# Altium schematic sheet Buck.SchDoc
size A4
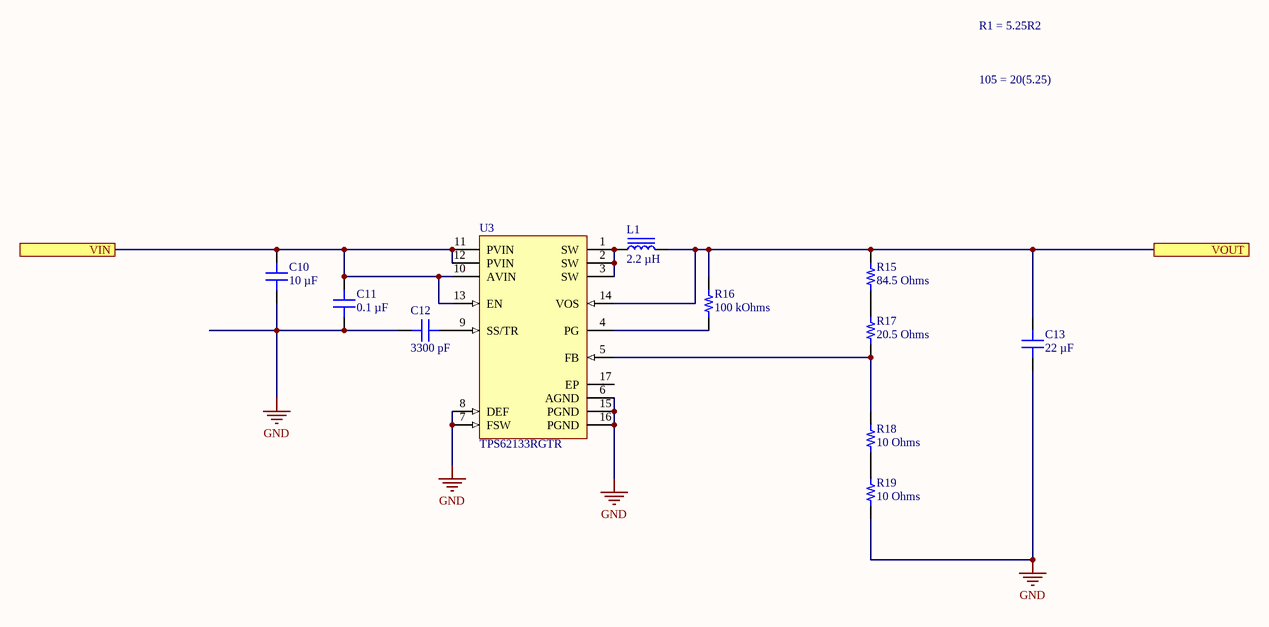
[diagram p0: Buck.SchDoc]

## Parts
C10  10 µF  [CAP 0805_2012]
C11  0.1 µF  [CAP 0805_2012]
C12  3300 pF  [CAP 0805_2012]
C13  22 µF  [CAP 0805_2012]
L1  2.2 µH  [BOURNS SRP5030T]
R15  84.5 Ohms  [RES 0805_2012]
R16  100 kOhms  [RES 0805_2012]
R17  20.5 Ohms  [RES 0805_2012]
R18  10 Ohms  [RES 0805_2012]
R19  10 Ohms  [RES 0805_2012]
U3  TPS62133RGTR  [RGT0016C_V]

## Ports
VIN, VOUT

## Nets
GND: C10.1 C11.1 C12.1 C13.1 R19.1 U3.6(AGND) U3.7(FSW) U3.8(DEF) U3.15(PGND) U3.16(PGND)
VIN: C10.2 C11.2 U3.10(AVIN) U3.11(PVIN) U3.12(PVIN) U3.13(EN) ; port VIN
VOUT: C13.2 L1.2 R15.2 R16.2 U3.14(VOS) ; port VOUT
NetC12_2: C12.2 U3.9(SS/TR)
NetL1_1: L1.1 U3.1(SW) U3.2(SW) U3.3(SW)
NetR15_1: R15.1 R17.2
NetR16_1: R16.1 U3.4(PG)
NetR17_1: R17.1 R18.2 U3.5(FB)
NetR18_1: R18.1 R19.2

Not connected (* = marked no-connect by the designer): U3 17(EP)

## Notes on the sheet
- R1 = 5.25R2
- 105 = 20(5.25)

## Library data of the parts
C10 = CL21Y106KPQVPNE: CAP CER 10UF 10V X7S 0805; manufacturer: Samsung Electro-Mechanics; Tolerance: ±10%; Part Number: CL21Y106KPQVPNE; Value: 10 µF; Applications: Automotive; Capacitance: 10 µF; componentlink1description: Datasheet; componentlink1url: http://www.samsungsem.com/kr/support/product-search/mlcc/CL21Y106KPQVPNE.jsp; componentlink2description: DigiKey Link; componentlink2url: https://www.digikey.com/en/products/detail/samsung-electro-mechanics/CL21Y106KPQVPNE/5961169; Device Package: 0805 (2012 Metric); lastupdated: 2023-10-22 7:13:43 PM; Lifecycle Status: Active; Minimum Order: 1; Mounting Type: Surface Mount, MLCC; Operating Temperature: -55°C ~ 125°C; Package / Case: 0805 (2012 Metric); packaging: TapeAndReel; partid: 2979; Part Status: Active; price: 0.06; Ratings: AEC-Q200; series: CL; Size / Dimension: 0.079" L x 0.049" W (2.00mm x 1.25mm); Supplier 1: DigiKey; Supplier Part Number 1: 1276-6685-1-ND; Temperature Coefficient: X7S; Thickness (Max): 0.055" (1.40mm); Voltage - Rated: 10V
C11 = CC0805MRX7R9BB104: CAP CER 0.1UF 50V X7R 0805; manufacturer: Yageo; Tolerance: ±20%; Part Number: CC0805MRX7R9BB104; Value: 0.1 µF; Applications: General Purpose; Capacitance: 0.1 µF; componentlink1description: Datasheet; componentlink1url: https://www.yageo.com/upload/media/product/productsearch/datasheet/mlcc/UPY-GPHC_X7R_6.3V-to-50V_18.pdf; componentlink2description: DigiKey Link; componentlink2url: https://www.digikey.com/en/products/detail/yageo/CC0805MRX7R9BB104/5884281; Device Package: 0805 (2012 Metric); lastupdated: 2023-10-22 7:13:44 PM; Lifecycle Status: Active; Minimum Order: 1; Mounting Type: Surface Mount, MLCC; Operating Temperature: -55°C ~ 125°C; Package / Case: 0805 (2012 Metric); packaging: TapeAndReel; partid: 2475; Part Status: Active; price: 0.01; series: CC; Size / Dimension: 0.079" L x 0.049" W (2.00mm x 1.25mm); Supplier 1: DigiKey; Supplier Part Number 1: 311-4351-1-ND; Temperature Coefficient: X7R; Thickness (Max): 0.037" (0.95mm); Voltage - Rated: 50V
C12 = C0805X332KARAC3316: CAP CER 0805 3.3NF 250V X7R; manufacturer: KEMET; Tolerance: ±10%; Part Number: C0805X332KARAC3316; Value: 3300 pF; Applications: Automotive, Boardflex Sensitive; Capacitance: 3300 pF; componentlink1description: Datasheet; componentlink1url: https://api.kemet.com/component-edge/download/datasheet/C0805X332KARAC3316.pdf; componentlink2description: DigiKey Link; componentlink2url: https://www.digikey.com/en/products/detail/kemet/C0805X332KARAC3316/10315785; Device Package: 0805 (2012 Metric); Features: Soft Termination; lastupdated: 2023-10-22 7:13:17 PM; Lifecycle Status: Active; Minimum Order: 1; Mounting Type: Surface Mount, MLCC; Operating Temperature: -55°C ~ 125°C; Package / Case: 0805 (2012 Metric); packaging: TapeAndReel; partid: 14175; Part Status: Active; price: 0.13; Ratings: AEC-Q200; series: SMD Auto X7R VW80808; Size / Dimension: 0.079" L x 0.049" W (2.00mm x 1.25mm); Supplier 1: DigiKey; Supplier Part Number 1: 399-C0805X332KARAC3316CT-ND; Temperature Coefficient: X7R; Thickness (Max): 0.039" (0.98mm); Voltage - Rated: 250V
C13 = CL21A226KOQNNNG: CAP CER 22UF 16V X5R 0805; manufacturer: Samsung Electro-Mechanics; Tolerance: ±10%; Part Number: CL21A226KOQNNNG; Value: 22 µF; Applications: General Purpose; Capacitance: 22 µF; componentlink1description: Datasheet; componentlink1url: //media.digikey.com/pdf/Data%20Sheets/Samsung%20PDFs/CL21A226KOQNNNG_Spec.pdf; componentlink2description: DigiKey Link; componentlink2url: https://www.digikey.com/en/products/detail/samsung-electro-mechanics/CL21A226KOQNNNG/3894433; Device Package: 0805 (2012 Metric); lastupdated: 2023-10-22 7:13:43 PM; Lifecycle Status: Active; Minimum Order: 1; Mounting Type: Surface Mount, MLCC; Operating Temperature: -55°C ~ 85°C; Package / Case: 0805 (2012 Metric); packaging: TapeAndReel; partid: 3000; Part Status: Active; price: 0.06; series: CL; Size / Dimension: 0.079" L x 0.049" W (2.00mm x 1.25mm); Supplier 1: DigiKey; Supplier Part Number 1: 1276-7092-1-ND; Temperature Coefficient: X5R; Thickness (Max): 0.055" (1.40mm); Voltage - Rated: 16V
L1 = SRP5030T-2R2M: FIXED IND 2.2UH 5.5A 35 MOHM SMD; Manufacturer: Bourns Inc.; Current - Saturation: 9A; DC Resistance (DCR): 35mOhm Max; Inductance Frequency - Test: 100 kHz; Material - Core: Iron Powder; Shielding: Shielded; Tolerance: ±20%; Type: Drum Core, Wirewound; Part Number: SRP5030T-2R2M; ComponentLink1Description: Datasheet; ComponentLink1URL: https://www.bourns.com/docs/Product-Datasheets/SRP5030T.pdf; ComponentLink2Description: DigiKey Link; ComponentLink2URL: https://www.digikey.com/en/products/detail/bourns-inc/SRP5030T-2R2M/3986082; Current Rating (Amps): 5.5 A; Device Package: Nonstandard; Height - Seated (Max): 0.118" (3.00mm); Inductance: 2.2 µH; LastUpdated: 2023-10-22 8:26:41 PM; Lifecycle Status: Active; Minimum Order: 1; Mounting Type: Surface Mount; Operating Temperature: -40°C ~ 125°C; Package / Case: Nonstandard; Packaging: TapeAndReel; PartId: 7; Part Status: Active; Price: 0.59; Series: SRP5030T; Size / Dimension: 0.224" L x 0.205" W (5.70mm x 5.20mm); Supplier 1: DigiKey; Supplier Part Number 1: SRP5030T-2R2MCT-ND; Value: 2.2 µH
R15 = ERA-6AEB84R5V: RES 84.5 OHM 0.1% 1/8W 0805; Manufacturer: Panasonic Electronic Components; Power (Watts): 0.125W, 1/8W; Temperature Coefficient: ±25ppm/°C; Part Number: ERA-6AEB84R5V; Value: 84.5 Ohms; ComponentLink1Description: Datasheet; ComponentLink1URL: https://industrial.panasonic.com/cdbs/www-data/pdf/RDM0000/AOA0000C307.pdf; ComponentLink2Description: DigiKey Link; ComponentLink2URL: https://www.digikey.com/en/products/detail/panasonic-electronic-components/ERA-6AEB84R5V/2025567; Composition: Thin Film; Device Package: 0805 (2012 Metric); Features: Automotive AEC-Q200; Height - Seated (Max): 0.024" (0.60mm); LastUpdated: 2023-10-22 7:54:59 PM; Lifecycle Status: Active; Minimum Order: 1; Number of Terminations: 2; Operating Temperature: -55°C ~ 155°C; Package / Case: 0805 (2012 Metric); Packaging: TapeAndReel; PartId: 35707; Part Status: Active; Price: 0.03; Ratings: AEC-Q200; Resistance: 84.5 Ohms; Series: ERA-6A; Size / Dimension: 0.079" L x 0.049" W (2.00mm x 1.25mm); Supplier 1: DigiKey; Supplier Part Number 1: P84.5DACT-ND; Supplier Device Package: 0805; Tolerance: ±0.1%
R16 = CPF0805B100KE: RES SMD 100K OHM 0.1% 1/10W 0805; Manufacturer: TE Connectivity Passive Product; Power (Watts): 0.1W, 1/10W; Temperature Coefficient: ±25ppm/°C; Part Number: CPF0805B100KE; Value: 100 kOhms; ComponentLink1Description: Datasheet; ComponentLink1URL: https://www.te.com/commerce/DocumentDelivery/DDEController?Action=srchrtrv&DocNm=1773200&DocType=DS&DocLang=English; ComponentLink2Description: DigiKey Link; ComponentLink2URL: https://www.digikey.com/en/products/detail/te-connectivity-passive-product/CPF0805B100KE/2389788; Composition: Thin Film; Device Package: 0805 (2012 Metric); Height - Seated (Max): 0.026" (0.65mm); LastUpdated: 2023-10-22 7:55:33 PM; Lifecycle Status: Active; Minimum Order: 1; Number of Terminations: 2; Operating Temperature: -55°C ~ 155°C; Package / Case: 0805 (2012 Metric); Packaging: TapeAndReel; PartId: 27729; Part Status: Active; Price: 0.09; Resistance: 100 kOhms; Series: CPF, Neohm; Size / Dimension: 0.079" L x 0.049" W (2.00mm x 1.25mm); Supplier 1: DigiKey; Supplier Part Number 1: A106042CT-ND; Supplier Device Package: 0805; Tolerance: ±0.1%
R17 = ERJ-6ENF20R5V: RES SMD 20.5 OHM 1% 1/8W 0805; Manufacturer: Panasonic Electronic Components; Power (Watts): 0.125W, 1/8W; Temperature Coefficient: ±100ppm/°C; Part Number: ERJ-6ENF20R5V; Value: 20.5 Ohms; ComponentLink1Description: Datasheet; ComponentLink1URL: https://industrial.panasonic.com/cdbs/www-data/pdf/RDA0000/AOA0000C304.pdf; ComponentLink2Description: DigiKey Link; ComponentLink2URL: https://www.digikey.com/en/products/detail/panasonic-electronic-components/ERJ-6ENF20R5V/110953; Composition: Thick Film; Device Package: 0805 (2012 Metric); Features: Automotive AEC-Q200; Height - Seated (Max): 0.028" (0.70mm); LastUpdated: 2023-10-22 7:55:22 PM; Lifecycle Status: Active; Minimum Order: 1; Number of Terminations: 2; Operating Temperature: -55°C ~ 155°C; Package / Case: 0805 (2012 Metric); Packaging: TapeAndReel; PartId: 30259; Part Status: Active; Price: 0.01; Ratings: AEC-Q200; Resistance: 20.5 Ohms; Series: ERJ-6EN; Size / Dimension: 0.079" L x 0.049" W (2.00mm x 1.25mm); Supplier 1: DigiKey; Supplier Part Number 1: P20.5CCT-ND; Supplier Device Package: 0805; Tolerance: ±1%
R18 R19 = RNCS0805BKE10R0: RES 10 OHM 0.1% 1/10W 0805; Manufacturer: Stackpole Electronics Inc; Power (Watts): 0.1W, 1/10W; Temperature Coefficient: ±25ppm/°C; Part Number: RNCS0805BKE10R0; Value: 10 Ohms; ComponentLink1Description: Datasheet; ComponentLink1URL: https://www.seielect.com/catalog/sei-rncs_rnch.pdf; ComponentLink2Description: DigiKey Link; ComponentLink2URL: https://www.digikey.com/en/products/detail/stackpole-electronics-inc/RNCS0805BKE10R0/1800064; Composition: Thin Film; Device Package: 0805 (2012 Metric); Features: Anti-Corrosive, Automotive AEC-Q200, Moisture Resistant; Height - Seated (Max): 0.026" (0.65mm); LastUpdated: 2023-10-22 7:55:33 PM; Lifecycle Status: Active; Minimum Order: 1; Number of Terminations: 2; Operating Temperature: -55°C ~ 155°C; Package / Case: 0805 (2012 Metric); Packaging: TapeAndReel; PartId: 27711; Part Status: Active; Price: 0.07; Ratings: AEC-Q200; Resistance: 10 Ohms; Series: RNCS; Size / Dimension: 0.079" L x 0.049" W (2.00mm x 1.25mm); Supplier 1: DigiKey; Supplier Part Number 1: RNCS0805BKE10R0CT-ND; Supplier Device Package: 0805; Tolerance: ±0.1%
U3 = CMP-0323-00146-3: Buck Step Down Regulator with 3 to 17 V Input and 5 V Output, -40 to 85 degC, 16-Pin QFN (RGT), Green (RoHS & no Sb/Br); Manufacturer: Texas Instruments; Preset Vout(V): 5; Regulated Outputs(#): 1; Synchronous Rectification: TRUE; Duty Cycle(Max)(%): 100; Vin(Min)(V): 3; Vin(Max)(V): 17; Rating: Catalog; SubFamily: Step-Down Regulator; Switch Current Limit(Typ)(A): 4.2; Iq(Typ)(mA): 0.017; ComponentLink1Description: Datasheet; PackageVersion: revH, Oct-2011; ComponentLink2URL: http://www.ti.com/litv/pdf/mpqf119g; Code_JEDEC: MO-220; ComponentLink2Description: Package Specification; Vout(Max)(V): 5; ComponentLink3URL: Samples URL:http://www.ti.com/product/tps62133#samples; PackageReference: RGT0016C; ComponentLink3Description: URL Link1; Mounting Technology: Surface Mount; DatasheetVersion: SLVSAG7; PartNumber: TPS62133RGTR; Iout(Max)(A): 3; Eco-Plan: Green (RoHS & no Sb/Br); PackageDescription: 16-Pin Plastic Quad Flat No-Lead, 3 x 3 mm Body, 0.5 mm Pitch, 1.7 x 1.7 mm Exposed Pad; Topology: Buck; Vout(Min)(V): 5; ComponentLink1URL: http://www.ti.com/general/docs/lit/getliterature.tsp?genericPartNumber=TPS62133&fileType=pdf